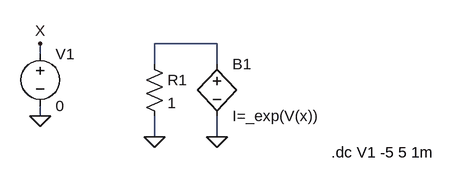
[diagram p0: schematic builtin_01_Draft1.asc]
builtin_01_Draft1.asc, the LTspice schematic file:
Version 4
SHEET 1 880 680
WIRE 224 80 128 80
WIRE -48 96 -48 80
WIRE 128 112 128 80
WIRE 224 112 224 80
WIRE -48 192 -48 176
WIRE 128 224 128 192
WIRE 224 224 224 192
FLAG 224 224 0
FLAG -48 192 0
FLAG -48 80 X
FLAG 128 224 0
SYMBOL bv 224 96 R0
SYMATTR InstName B1
SYMATTR Value I=_exp(V(x))
SYMBOL voltage -48 80 R0
SYMATTR InstName V1
SYMATTR Value 0
SYMBOL res 112 96 R0
SYMATTR InstName R1
SYMATTR Value 1
TEXT 400 248 Left 2 !.dc V1 -5 5 1m

The netlist it stands for:
* builtin_01_Draft1.asc
B1 N001 0 I=_exp(V(x))
V1 X 0 0
R1 N001 0 1
.dc V1 -5 5 1m
.backanno
.end